# Altium project PCB_Project2.PrjPCB
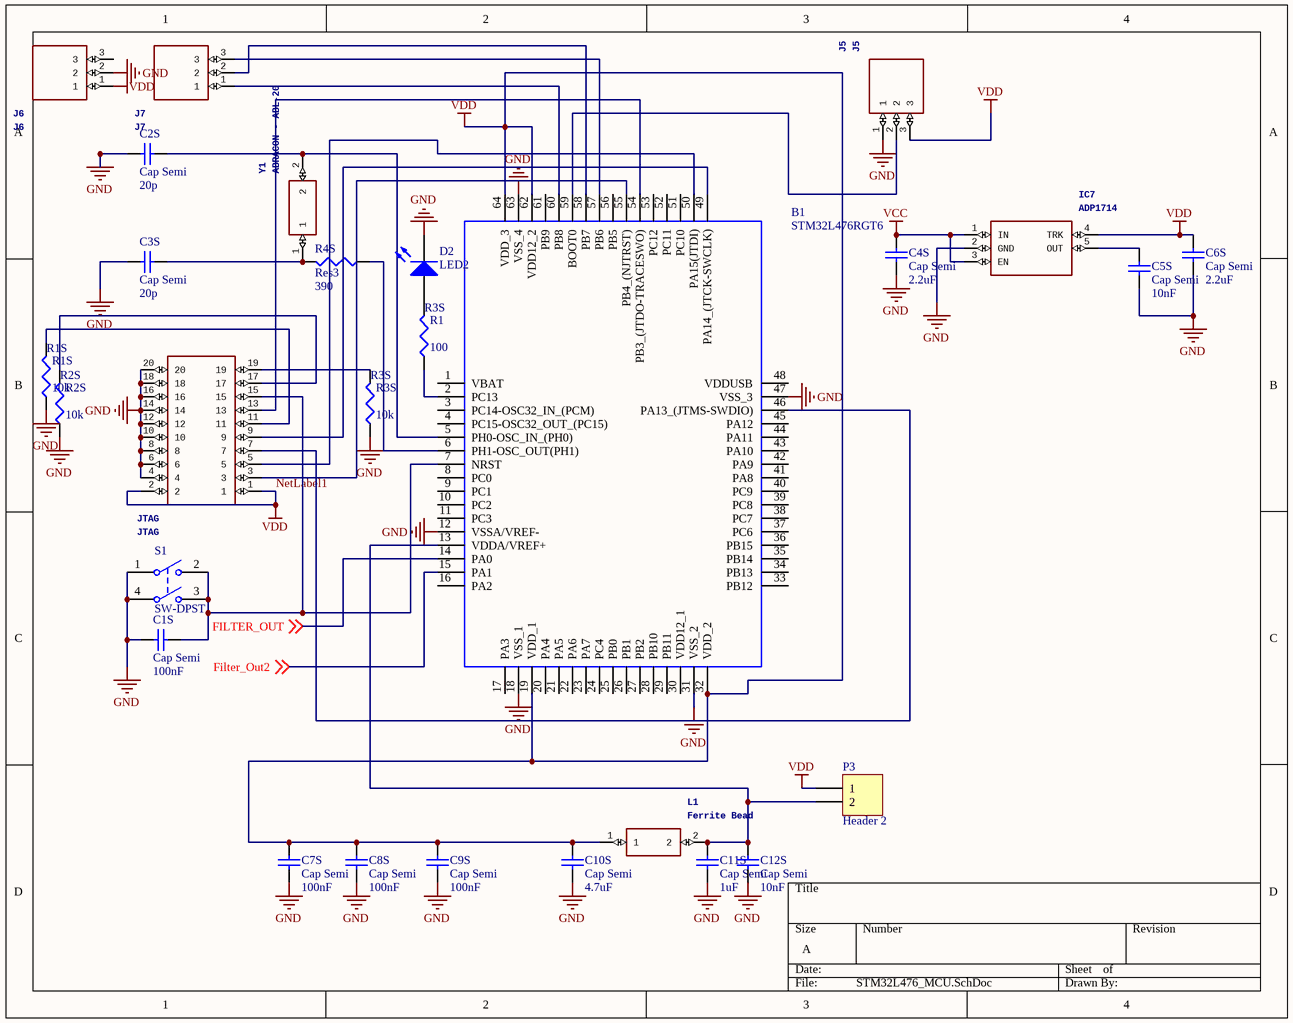
[diagram p0: STM32L476_MCU.SchDoc]
4 sheets, 109 parts. Net scope: global (net labels, ports and power ports of the same name join across sheets).
Board file: PCB1.PcbDoc
Sheets:
  STM32L476_MCU.SchDoc
  Power_Supply.SchDoc
  Mic_Circuit.SchDoc
  ButterWorth_8th_order_Filter.SchDoc

## Sheet STM32L476_MCU.SchDoc
size A

### Parts
B1  STM32L476RGT6  [QFP50P1200X1200X160-64N]
C1S  Cap Semi  value 100nF  [1608[0603]]
C2S  Cap Semi  value 20p  [1608[0603]]
C3S  Cap Semi  value 20p  [1608[0603]]
C4S  Cap Semi  value 2.2uF  [1608[0603]]
C5S  Cap Semi  value 10nF  [1608[0603]]
C6S  Cap Semi  value 2.2uF  [1608[0603]]
C7S  Cap Semi  value 100nF  [1608[0603]]
C8S  Cap Semi  value 100nF  [1608[0603]]
C9S  Cap Semi  value 100nF  [1608[0603]]
C10S  Cap Semi  value 4.7uF  [1608[0603]]
C11S  Cap Semi  value 1uF  [1608[0603]]
C12S  Cap Semi  value 10nF  [1608[0603]]
D2  LED2  [1608[0603]]
IC7  ADP1714  [SOT95P280X100-5N]
J5  J5  [HDRV3W95P0X254_1X3_762X254X869]
J6  J6  [HDRV3W95P0X254_1X3_762X254X869]
J7  J7  [HDRV3W95P0X254_1X3_762X254X869]
JTAG  JTAG  [SAMTEC_SSW-110-01-G]
L1  Ferrite Bead  [BEADC1608X95N]
P3  Header 2  [HDR1X2]
R1  R3S  value 100  [1608[0603]]
R1S  R1S  value 10k  [1608[0603]]
R2S  R2S  value 10k  [1608[0603]]
R3S  R3S  value 10k  [1608[0603]]
R4S  Res3  value 390  [1608[0603]]
S1  SW-DPST  [D6C10F1LFS]
Y1  ABRACON - ABL-20  [HC/49US_(AT49)PTH]

### Nets
GND: B1.12(VSSA/VREF-) B1.18(VSS_1) B1.31(VSS_2) B1.47(VSS_3) B1.63(VSS_4) C1S.1 C2S.1 C3S.1 C4S.1 C5S.1 C6S.1 C7S.1 C8S.1 C9S.1 C10S.1 C11S.1 C12S.1 D2.2(K) IC7.2(GND) J5.1 J6.2 JTAG.4 JTAG.6 JTAG.8 JTAG.10 JTAG.12 JTAG.14 JTAG.16 JTAG.18 JTAG.20 R1S.2 R2S.2 R3S.2 S1.1(COMMON1) S1.4(COMMON2)
VCC: C4S.2 IC7.1(IN) IC7.3(EN)
VDD: B1.19(VDD_1) B1.32(VDD_2) B1.62(VDD12_2) B1.64(VDD_3) C6S.2 C7S.2 C8S.2 C9S.2 C10S.2 IC7.4(TRK) J5.3 J6.1 JTAG.1 JTAG.2 L1.1 P3.1  [also labelled NetLabel1]
FILTER_OUT: B1.14(PA0) ; off-sheet FILTER_OUT
Filter_Out2: B1.15(PA1) ; off-sheet Filter_Out2
NetB1_2: B1.2(PC13) R1.2
NetB1_5: B1.5(PH0-OSC_IN_(PH0)) C2S.2 Y1.2
NetB1_6: B1.6(PH1-OSC_OUT(PH1)) R4S.2
NetB1_7: B1.7(NRST) C1S.2 JTAG.15 S1.2(NO1) S1.3(NO2)
NetB1_13: B1.13(VDDA/VREF+) C11S.2 C12S.2 L1.2 P3.2
NetB1_46: B1.46(PA13_(JTMS-SWDIO)) JTAG.7
NetB1_49: B1.49(PA14_(JTCK-SWCLK)) JTAG.9
NetB1_50: B1.50(PA15(JTDI)) JTAG.5
NetB1_54: B1.54(PB3_(JTDO-TRACESWO)) JTAG.13
NetB1_55: B1.55(PB4_(NJTRST)) JTAG.3
NetB1_57: B1.57(PB6) J7.3
NetB1_58: B1.58(PB7) J7.2
NetB1_59: B1.59(BOOT0) J5.2
NetB1_60: B1.60(PB8) J7.1
NetC3S_2: C3S.2 R4S.1 Y1.1
NetC5S_2: C5S.2 IC7.5(OUT)
NetD2_1: D2.1(A) R1.1
NetJTAG_11: JTAG.11 R1S.1
NetJTAG_17: JTAG.17 R2S.1
NetJTAG_19: JTAG.19 R3S.1

Not connected (* = marked no-connect by the designer): B1 1(VBAT) 3(PC14-OSC32_IN_(PCM)) 4(PC15-OSC32_OUT_(PC15)) 8(PC0) 9(PC1) 10(PC2) 11(PC3) 16(PA2) 17(PA3) 20(PA4) 21(PA5) 22(PA6) 23(PA7) 24(PC4) 25(PB0) 26(PB1) 27(PB2) 28(PB10) 29(PB11) 30(VDD12_1) 33(PB12) 34(PB13) 35(PB14) 36(PB15) 37(PC6) 38(PC7) 39(PC8) 40(PC9) 41(PA8) 42(PA9) 43(PA10) 44(PA11) 45(PA12) 48(VDDUSB) 51(PC10) 52(PC11) 53(PC12) 56(PB5) 61(PB9); J6 3

### Library data of the parts
B1 = STM32L476RGT6: ARM MCU 32-bit 80MHz 1024KB  LQFP64 STMicroelectronics STM32L476RGT6, 32bit ARM Cortex M4 MCU, 80MHz, 1 MB Flash, 64-Pin LQFP; Geometry.Height: 1.6mm; Manufacturer_Name: STMicroelectronics; Manufacturer_Part_Number: STM32L476RGT6; RS Part Number: 1658235; RS Price/Stock: http://uk.rs-online.com/web/p/products/1658235; Arrow Part Number: STM32L476RGT6; Arrow Price/Stock: https://www.arrow.com/en/products/stm32l476rgt6/stmicroelectronics; Datasheet Link: https://componentsearchengine.com/Datasheets/1/STM32L476RGT6.pdf
C1S C2S C3S C4S C5S C6S C7S C8S C9S C10S C11S C12S = Cap Semi: Capacitor (Semiconductor SIM Model); Published: 8-Jun-2000; LatestRevisionDate: 29-May-2009; LatestRevisionNote: IPC-7351 Footprint Added.; PackageReference: C1206; Publisher: Altium Limited; PackageDescription: Chip Capacitor
D2 = LED2: Typical RED, GREEN, YELLOW, AMBER GaAs LED; Published: 8-Jun-2000; LatestRevisionDate: 17-Jul-2002; LatestRevisionNote: Re-released for DXP Platform.; PackageVersion: Feb-2002; PackageReference: 3.2X1.6X1.1; Publisher: Altium Limited; PackageDescription: SM LED; 2 Flat Leads
IC7 = ADP1714AUJZ-3.3-R7: Manufacturer_Name: Analog Devices; GateName_1: G$1; SymbolName_1: ADP1714AUJZ-3.3-R7; LibraryName: ADP1714AUJZ-3.3-R7; DeviceSetName: ADP1714AUJZ-3.3-R7; Package: SOT95P280X100-5N; Manufacturer_Part_Number: ADP1714AUJZ-3.3-R7; Arrow_Part_Number: ADP1714AUJZ-3.3-R7; Height: mm
J5-J7 = 61300311121: Manufacturer_Name: Wurth Elektronik; GateName_1: G$1; SymbolName_1: 61300311121; LibraryName: 61300311121; DeviceSetName: 61300311121; Package: HDRV3W95P0X254_1X3_762X254X869; Manufacturer_Part_Number: 61300311121; RS_Part_Number: 1725145; RS_Price-Stock: http://uk.rs-online.com/web/p/products/1725145; Arrow_Part_Number: 61300311121; Arrow_Price-Stock: http://uk.rs-online.com/web/p/products/1725145; Height: 8.69mm
JTAG = SSW-110-01-G-D: Manufacturer_Name: SAMTEC; GateName_1: G$1; SymbolName_1: SSW-110-01-G-D; LibraryName: SSW-110-01-G-D; DeviceSetName: SSW-110-01-G-D; Package: SAMTEC_SSW-110-01-G; Manufacturer_Part_Number: SSW-110-01-G-D; RS_Part_Number: 7655727P; RS_Price-Stock: http://uk.rs-online.com/web/p/products/7655727P; Arrow_Part_Number: SSW-110-01-G-D; Arrow_Price-Stock: https://www.arrow.com/en/products/ssw-110-01-g-d/samtec; Height: mm
L1 = BK1608HS601-T: Manufacturer_Name: TAIYO YUDEN; GateName_1: G$1; SymbolName_1: BK1608HS601-T; LibraryName: BK1608HS601-T; DeviceSetName: BK1608HS601-T; Package: BEADC1608X95N; Manufacturer_Part_Number: BK1608HS601-T; Arrow_Part_Number: BK1608HS601-T; Height: 0.95mm
P3 = Header 2: Header, 2-Pin; LatestRevisionDate: 17-Jul-2002; LatestRevisionNote: Re-released for DXP Platform.; Publisher: Altium Limited
R1 R1S R2S R3S R4S = Res3: Resistor; Published: 8-Jun-2000; LatestRevisionDate: 29-May-2009; LatestRevisionNote: IPC-7351 Footprint Added.; PackageReference: J1-0603; Publisher: Altium Limited; PackageDescription: Chip Resistor
S1 = SW-DPST: Double-Pole, Single-Throw Switch; Published: 24-Mar-1999; LatestRevisionDate: 17-Jul-2002; LatestRevisionNote: Re-released for DXP Platform.; PackageReference: DPST-4; Publisher: Altium Limited; PackageDescription: Switch; 4 Leads
Y1 = ABL-20.000MHZ-B2: GateName_1: G$1; SymbolName_1: ABL-20.000MHZ-B2; LibraryName: ABL-20.000MHZ-B2; DeviceSetName: ABL-20.000MHZ-B2; Package: HC/49US_(AT49)PTH; Manufacturer_Name: ABRACON; Manufacturer_Part_Number: ABL-20.000MHZ-B2; RS_Part_Number: 1710202; RS_Price-Stock: http://uk.rs-online.com/web/p/products/1710202; Arrow_Part_Number: ABL-20.000MHZ-B2; Arrow_Price-Stock: https://www.arrow.com/en/products/abl-20.000mhz-b2/abracon; Height: mm

## Sheet Power_Supply.SchDoc
size A
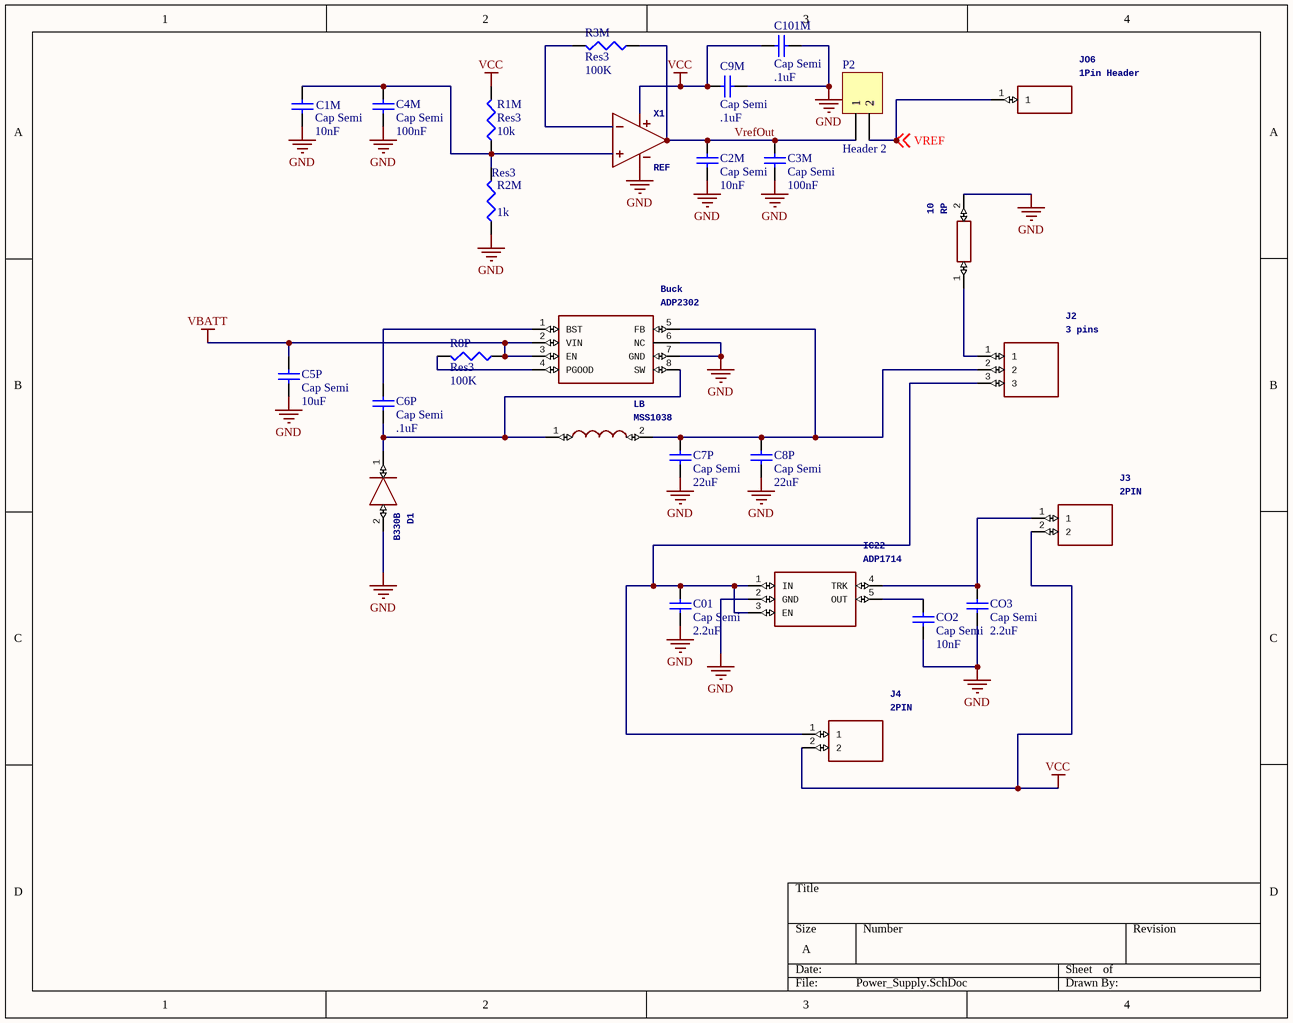
[diagram p1: Power_Supply.SchDoc]

### Parts
10  RP  [RESAD3800W75L1600D550]
Buck  ADP2302  [SOIC127P600X175-9N]
C01  Cap Semi  value 2.2uF  [1608[0603]]
C1M  Cap Semi  value 10nF  [CAPPM6032X280N]
C2M  Cap Semi  value 10nF  [CAPPM6032X280N]
C3M  Cap Semi  value 100nF  [1608[0603]]
C4M  Cap Semi  value 100nF  [1608[0603]]
C5P  Cap Semi  value 10uF  [1608[0603]]
C6P  Cap Semi  value .1uF  [1608[0603]]
C7P  Cap Semi  value 22uF  [1608[0603]]
C8P  Cap Semi  value 22uF  [1608[0603]]
C9M  Cap Semi  value .1uF  [1608[0603]]
C101M  Cap Semi  value .1uF  [CAPPM6032X280N]
CO2  Cap Semi  value 10nF  [1608[0603]]
CO3  Cap Semi  value 2.2uF  [1608[0603]]
D1  B330B  [DIOM5336X250N]
IC22  ADP1714  [SOT95P280X100-5N]
J2  3 pins  [HDRV3W95P0X254_1X3_762X254X869]
J3  2PIN  [HDRV2W110P0X254_1X2_508X254X85]
J4  2PIN  [HDRV2W110P0X254_1X2_508X254X85]
JO6  1Pin Header  [68000-401HLF]
LB  MSS1038  [INDM102102X400N]
P2  Header 2  [HDRV2W110P0X254_1X2_508X254X85]
R1M  Res3  value 10k  [1608[0603]]
R2M  Res3  value 1k  [1608[0603]]
R3M  Res3  value 100K  [1608[0603]]
R8P  Res3  value 100K  [1608[0603]]
X1  REF  [SOT95P290X145-5N]

### Nets
GND: 10.2 Buck.6(NC) Buck.7(GND) C01.1 C1M.1 C2M.1 C3M.1 C4M.1 C5P.1 C7P.1 C8P.1 C9M.1 C101M.1 CO2.1 CO3.1 D1.2(A) IC22.2(GND) R2M.2 X1.2(V-)
VBATT: Buck.2(VIN) Buck.3(EN) C5P.2 R8P.2
VCC: C9M.2 C101M.2 J3.2 J4.2 R1M.1 X1.5(V+)
VREF: JO6.1 P2.2 ; off-sheet VREF
VrefOut: C2M.2 C3M.2 P2.1 R3M.2 X1.1(OUT)
Net10_1: 10.1 J2.1
NetBuck_1: Buck.1(BST) C6P.2
NetBuck_4: Buck.4(PGOOD) R8P.1
NetBuck_5: Buck.5(FB) C7P.2 C8P.2 J2.2 LB.2
NetBuck_8: Buck.8(SW) C6P.1 D1.1(K) LB.1
NetC01_2: C01.2 IC22.1(IN) IC22.3(EN) J2.3 J4.1
NetC1M_2: C1M.2 C4M.2 R1M.2 R2M.1 X1.3(IN+)
NetCO2_2: CO2.2 IC22.5(OUT)
NetCO3_2: CO3.2 IC22.4(TRK) J3.1
NetR3M_1: R3M.1 X1.4(IN-)

### Library data of the parts
10 = ROX3SJ220R: Manufacturer_Name: TE Connectivity; GateName_1: G$1; Allied_Number: 70063816; SymbolName_1: ROX3SJ220R; LibraryName: ROX3SJ220R; DeviceSetName: ROX3SJ220R; Package: RESAD3800W75L1600D550; Manufacturer_Part_Number: ROX3SJ220R; RS_Part_Number: 1615998; RS_Price-Stock: http://uk.rs-online.com/web/p/products/1615998; Allied_Price-Stock: https://www.alliedelec.com/te-connectivity-rox3sj220r/70063816/; Arrow_Part_Number: ROX3SJ220R; Arrow_Price-Stock: https://www.arrow.com/en/products/rox3sj220r/te-connectivity; Height: mm
Buck = ADP2302ARDZ-5.0-R7: Manufacturer_Name: Analog Devices; GateName_1: G$1; SymbolName_1: ADP2302ARDZ-5.0-R7; LibraryName: ADP2302ARDZ-5.0-R7; DeviceSetName: ADP2302ARDZ-5.0-R7; Package: SOIC127P600X175-9N; Manufacturer_Part_Number: ADP2302ARDZ-5.0-R7; RS_Part_Number: 7591815P; RS_Price-Stock: http://uk.rs-online.com/web/p/products/7591815P; Arrow_Part_Number: ADP2302ARDZ-5.0-R7; Arrow_Price-Stock: https://www.arrow.com/en/products/adp2302ardz-5.0-r7/analog-devices; Height: mm
C01 C1M C2M C3M C4M C5P C6P C7P C8P C9M C101M CO2 CO3 = Cap Semi: Capacitor (Semiconductor SIM Model); Published: 8-Jun-2000; LatestRevisionDate: 29-May-2009; LatestRevisionNote: IPC-7351 Footprint Added.; PackageReference: C1206; Publisher: Altium Limited; PackageDescription: Chip Capacitor
D1 = B330B-13-F: Manufacturer_Name: Diodes Inc.; GateName_1: G$1; SymbolName_1: B330B-13-F; LibraryName: B330B-13-F; DeviceSetName: B330B-13-F; Package: DIOM5336X250N; Manufacturer_Part_Number: B330B-13-F; RS_Part_Number: 9228339; RS_Price-Stock: http://uk.rs-online.com/web/p/products/9228339; Arrow_Part_Number: B330B-13-F; Arrow_Price-Stock: https://www.arrow.com/en/products/b330b-13-f/diodes-incorporated; Height: 2.5mm
IC22 = ADP1714AUJZ-3.3-R7: as IC7 on sheet STM32L476_MCU; SymbolName_1: ADP1714AUJZ-3.3-R7; LibraryName: ADP1714AUJZ-3.3-R7; DeviceSetName: ADP1714AUJZ-3.3-R7; Package: SOT95P280X100-5N; Manufacturer_Part_Number: ADP1714AUJZ-3.3-R7; Arrow_Part_Number: ADP1714AUJZ-3.3-R7; Height: mm
J2 = 61300311121: as J5 on sheet STM32L476_MCU; SymbolName_1: 61300311121; LibraryName: 61300311121; DeviceSetName: 61300311121; Package: HDRV3W95P0X254_1X3_762X254X869; Manufacturer_Part_Number: 61300311121; RS_Part_Number: 1725145; RS_Price-Stock: http://uk.rs-online.com/web/p/products/1725145; Arrow_Part_Number: 61300311121; Arrow_Price-Stock: http://uk.rs-online.com/web/p/products/1725145; Height: 8.69mm
J3 J4 = 61300211121: Manufacturer_Name: Wurth Elektronik; GateName_1: G$1; SymbolName_1: 61300211121; LibraryName: 61300211121; DeviceSetName: 61300211121; Package: HDRV2W110P0X254_1X2_508X254X85; Manufacturer_Part_Number: 61300211121; RS_Part_Number: 8281581P; RS_Price-Stock: http://uk.rs-online.com/web/p/products/8281581P; Arrow_Part_Number: 61300211121; Arrow_Price-Stock: http://uk.rs-online.com/web/p/products/8281581P; Height: 8.54mm
JO6 = 68000-401HLF: Manufacturer_Name: FCI; GateName_1: G$1; SymbolName_1: 68000-401HLF; LibraryName: 68000-401HLF; DeviceSetName: 68000-401HLF; Package: 68000-401HLF; Manufacturer_Part_Number: 68000-401HLF; RS_Part_Number: 8632706; RS_Price-Stock: http://uk.rs-online.com/web/p/products/8632706; Arrow_Part_Number: 68000-401HLF; Arrow_Price-Stock: https://www.arrow.com/en/products/68000-401hlf/amphenol-fci; Height: mm
LB = MSS1038-183MLB: Manufacturer_Name: COILCRAFT; GateName_1: G$1; SymbolName_1: MSS1038-183MLB; LibraryName: MSS1038-183MLB; DeviceSetName: MSS1038-183MLB; Package: INDM102102X400N; Manufacturer_Part_Number: MSS1038-183MLB; Arrow_Part_Number: MSS1038-183MLB; Height: 4mm
P2 = Header 2: Header, 2-Pin; LatestRevisionDate: 17-Jul-2002; LatestRevisionNote: Re-released for DXP Platform.; Publisher: Altium Limited
R1M R2M R3M R8P = Res3: Resistor; Published: 8-Jun-2000; LatestRevisionDate: 29-May-2009; LatestRevisionNote: IPC-7351 Footprint Added.; PackageReference: J1-0603; Publisher: Altium Limited; PackageDescription: Chip Resistor
X1 = OPAMP2: GateName_1: G$1; SymbolName_1: OPAMP2; LibraryName: Opamps; DeviceSetName: OPAMP2; Package: S8

## Sheet Mic_Circuit.SchDoc
size A
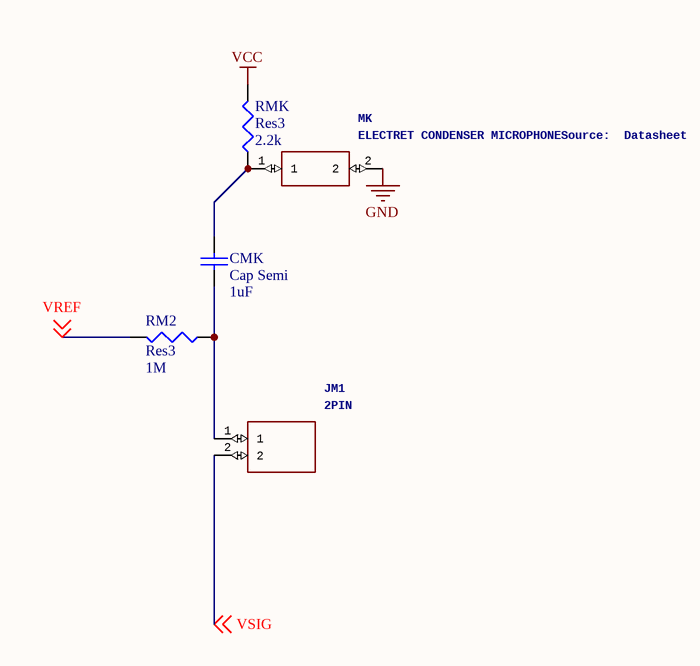
[diagram p2: Mic_Circuit.SchDoc]

### Parts
CMK  Cap Semi  value 1uF  [1608[0603]]
JM1  2PIN  [HDRV2W110P0X254_1X2_508X254X85]
MK  ELECTRET CONDENSER MICROPHONESource:  Datasheet  [CMA-4544PF-W]
RM2  Res3  value 1M  [1608[0603]]
RMK  Res3  value 2.2k  [1608[0603]]

### Nets
GND: MK.2
VCC: RMK.1
VREF: RM2.1 ; off-sheet VREF
VSIG: JM1.2 ; off-sheet VSIG
NetCMK_1: CMK.1 JM1.1 RM2.2
NetCMK_2: CMK.2 MK.1 RMK.2

### Library data of the parts
CMK = Cap Semi: Capacitor (Semiconductor SIM Model); Published: 8-Jun-2000; LatestRevisionDate: 29-May-2009; LatestRevisionNote: IPC-7351 Footprint Added.; PackageReference: C1206; Publisher: Altium Limited; PackageDescription: Chip Capacitor
JM1 = 61300211121: as J3 on sheet Power_Supply; SymbolName_1: 61300211121; LibraryName: 61300211121; DeviceSetName: 61300211121; Package: HDRV2W110P0X254_1X2_508X254X85; Manufacturer_Part_Number: 61300211121; RS_Part_Number: 8281581P; RS_Price-Stock: http://uk.rs-online.com/web/p/products/8281581P; Arrow_Part_Number: 61300211121; Arrow_Price-Stock: http://uk.rs-online.com/web/p/products/8281581P; Height: 8.54mm
MK = CMA-4544PF-W: Manufacturer_Name: CUI; GateName_1: G$1; SymbolName_1: CMA-4544PF-W; LibraryName: CMA-4544PF-W; DeviceSetName: CMA-4544PF-W; Package: CMA-4544PF-W; Manufacturer_Part_Number: CMA-4544PF-W; Arrow_Part_Number: CMA-4544PF-W; Arrow_Price-Stock: https://www.arrow.com/en/products/cma-4544pf-w/cui-inc; Height: mm
RM2 RMK = Res3: Resistor; Published: 8-Jun-2000; LatestRevisionDate: 29-May-2009; LatestRevisionNote: IPC-7351 Footprint Added.; PackageReference: J1-0603; Publisher: Altium Limited; PackageDescription: Chip Resistor

## Sheet ButterWorth_8th_order_Filter.SchDoc
size B
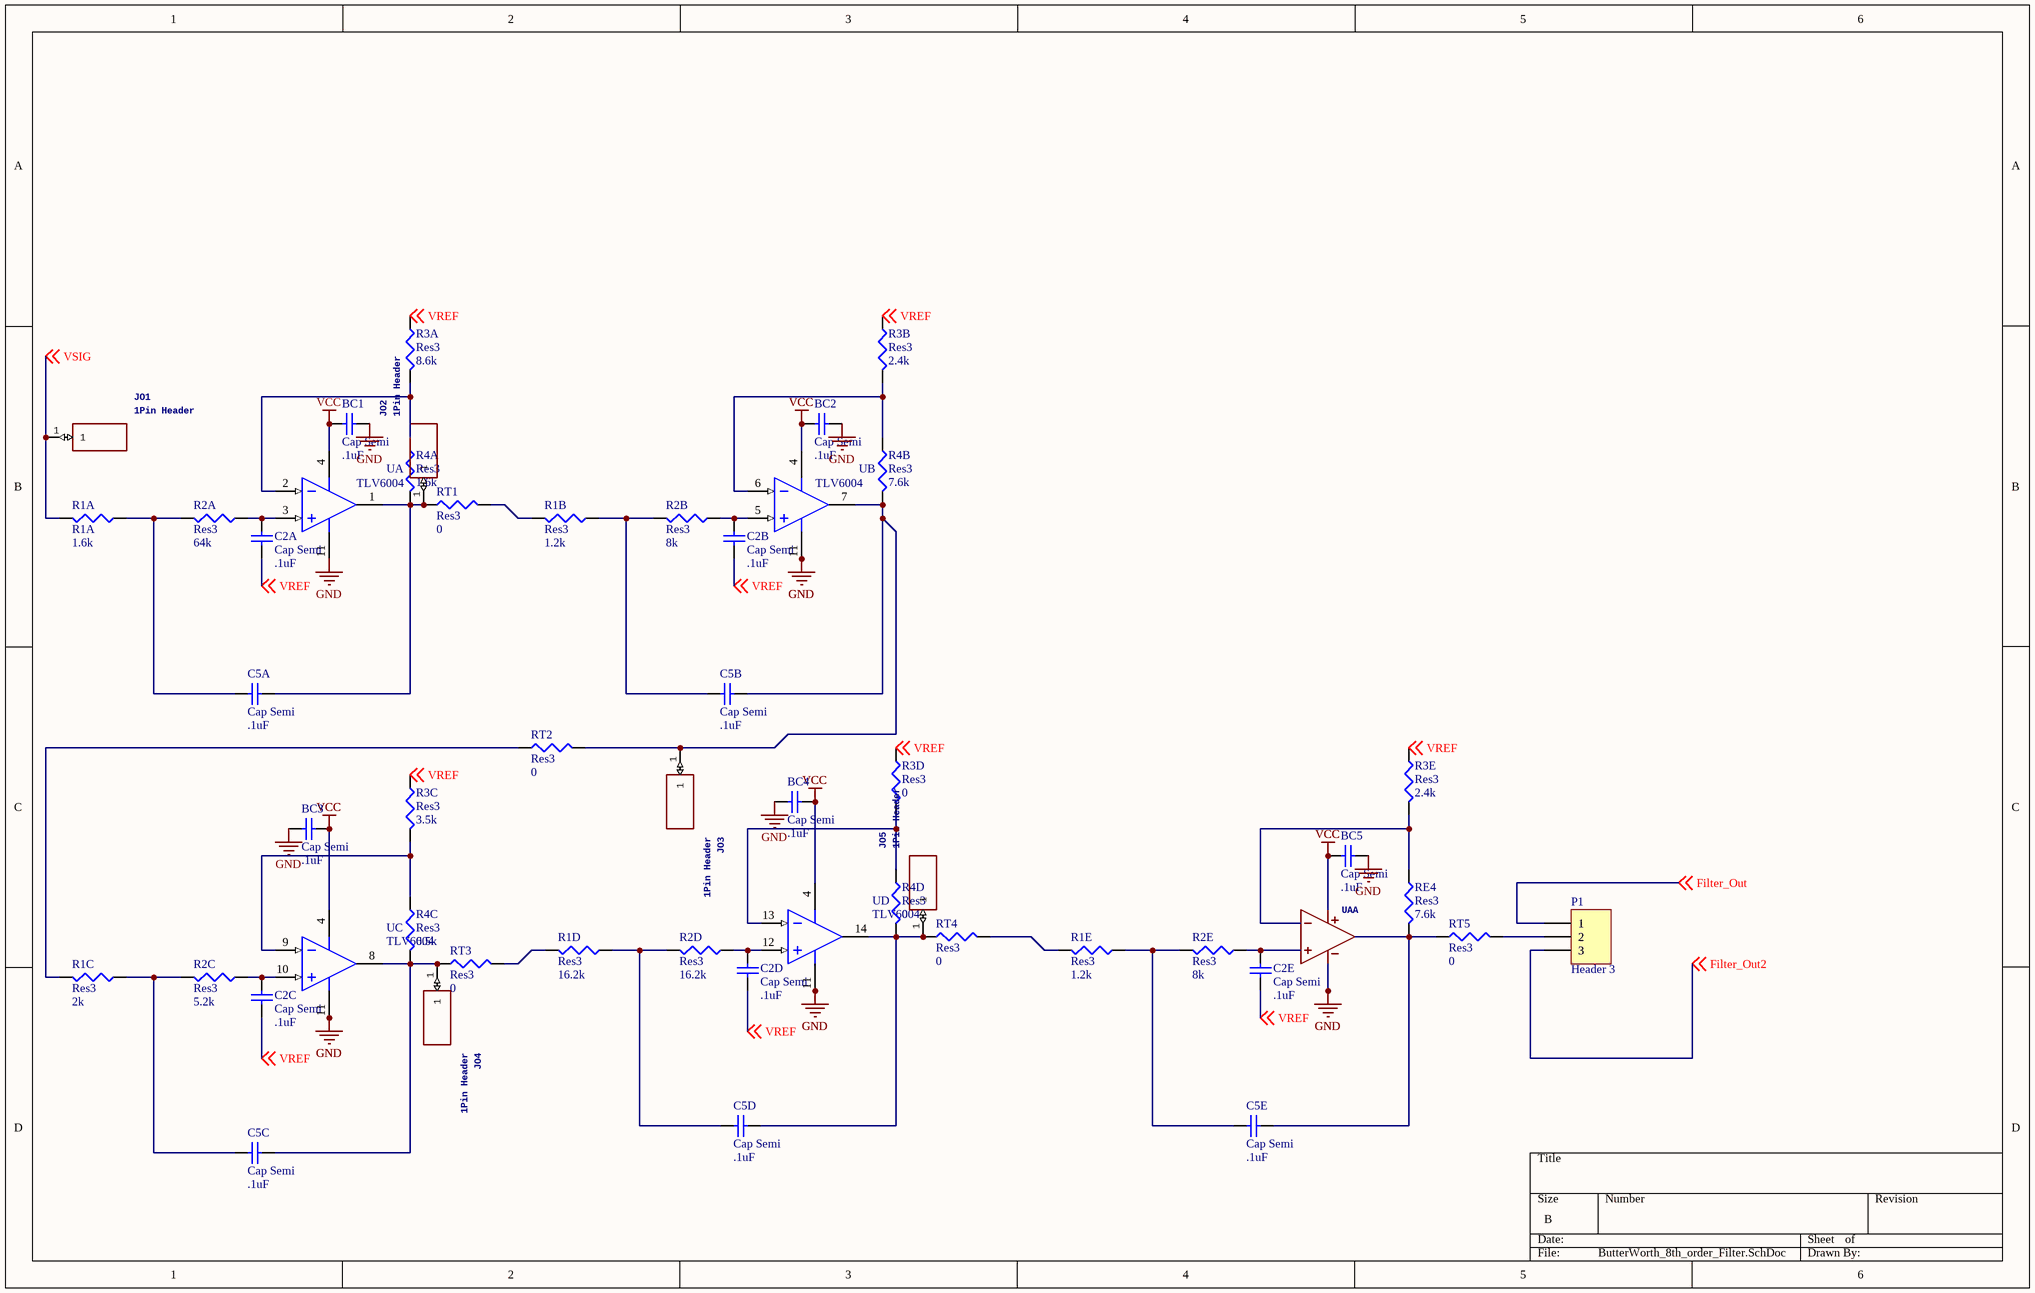
[diagram p3: ButterWorth_8th_order_Filter.SchDoc]

### Parts
BC1  Cap Semi  value .1uF  [1608[0603]]
BC2  Cap Semi  value .1uF  [1608[0603]]
BC3  Cap Semi  value .1uF  [1608[0603]]
BC4  Cap Semi  value .1uF  [1608[0603]]
BC5  Cap Semi  value .1uF  [1608[0603]]
C2A  Cap Semi  value .1uF  [1608[0603]]
C2B  Cap Semi  value .1uF  [1608[0603]]
C2C  Cap Semi  value .1uF  [1608[0603]]
C2D  Cap Semi  value .1uF  [1608[0603]]
C2E  Cap Semi  value .1uF  [1608[0603]]
C5A  Cap Semi  value .1uF  [C1206]
C5B  Cap Semi  value .1uF  [C1206]
C5C  Cap Semi  value .1uF  [C1206]
C5D  Cap Semi  value .1uF  [C1206]
C5E  Cap Semi  value .1uF  [C1206]
JO1  1Pin Header  [68000-401HLF]
JO2  1Pin Header  [68000-401HLF]
JO3  1Pin Header  [68000-401HLF]
JO4  1Pin Header  [68000-401HLF]
JO5  1Pin Header  [68000-401HLF]
P1  Header 3  [HDRV3W95P0X254_1X3_762X254X869]
R1A  R1A  value 1.6k  [1608[0603]]
R1B  Res3  value 1.2k  [1608[0603]]
R1C  Res3  value 2k  [1608[0603]]
R1D  Res3  value 16.2k  [1608[0603]]
R1E  Res3  value 1.2k  [1608[0603]]
R2A  Res3  value 64k  [1608[0603]]
R2B  Res3  value 8k  [1608[0603]]
R2C  Res3  value 5.2k  [1608[0603]]
R2D  Res3  value 16.2k  [1608[0603]]
R2E  Res3  value 8k  [1608[0603]]
R3A  Res3  value 8.6k  [1608[0603]]
R3B  Res3  value 2.4k  [1608[0603]]
R3C  Res3  value 3.5k  [1608[0603]]
R3D  Res3  value 0  [1608[0603]]
R3E  Res3  value 2.4k  [1608[0603]]
R4A  Res3  value 1.6k  [1608[0603]]
R4B  Res3  value 7.6k  [1608[0603]]
R4C  Res3  value 6.5k  [1608[0603]]
R4D  Res3  value 0  [1608[0603]]
RE4  Res3  value 7.6k  [1608[0603]]
RT1  Res3  value 0  [1608[0603]]
RT2  Res3  value 0  [1608[0603]]
RT3  Res3  value 0  [1608[0603]]
RT4  Res3  value 0  [1608[0603]]
RT5  Res3  value 0  [1608[0603]]
U  TLV6004  [SOP65P640X120-14N]  (parts A,B,C,D of 4)
UAA  Universal Opamp model that allows 4 different levels of simulation accuracy.  See ./examples/Educational/UniversalOpamp2.asc for details.  En and in are equivalent voltage and current noises.  Enk and ink are the respective corner frequencies.  Phimargin is used to set the 2nd pole or delay to the approximate phase margin for level.3a and level.3b.  This version uses the new, experimental level 2 switch as the output devices.  [SOT95P280X100-5N]  (value not drawn)

### Nets
GND: BC1.1 BC2.1 BC3.2 BC4.2 BC5.1 U.11(V-) UAA.2(V-)
VCC: BC1.2 BC2.2 BC3.1 BC4.1 BC5.2 U.4(V+) UAA.5(V+)
FILTER_OUT: P1.1 ; off-sheet Filter_Out
Filter_Out2: P1.3 ; off-sheet Filter_Out2
VREF: C2A.1 C2B.1 C2C.1 C2D.1 C2E.1 R3A.2 R3B.2 R3C.2 R3D.2 R3E.2 ; off-sheet VREF
VSIG: JO1.1 R1A.1 ; off-sheet VSIG
NetC2A_2: C2A.2 R2A.2 U.3(IN+)
NetC2B_2: C2B.2 R2B.2 U.5(IN+)
NetC2C_2: C2C.2 R2C.2 U.10(IN+)
NetC2D_2: C2D.2 R2D.2 U.12(IN+)
NetC2E_2: C2E.2 R2E.2 UAA.3(IN+)
NetC5A_1: C5A.1 JO2.1 R4A.1 RT1.2 U.1(OUT)
NetC5A_2: C5A.2 R1A.2 R2A.1
NetC5B_1: C5B.1 JO3.1 R4B.1 RT2.1 U.7(OUT)
NetC5B_2: C5B.2 R1B.2 R2B.1
NetC5C_1: C5C.1 JO4.1 R4C.1 RT3.2 U.8(OUT)
NetC5C_2: C5C.2 R1C.2 R2C.1
NetC5D_1: C5D.1 JO5.1 R4D.1 RT4.2 U.14(OUT)
NetC5D_2: C5D.2 R1D.2 R2D.1
NetC5E_1: C5E.1 RE4.1 RT5.2 UAA.1(OUT)
NetC5E_2: C5E.2 R1E.2 R2E.1
NetP1_2: P1.2 RT5.1
NetR1B_1: R1B.1 RT1.1
NetR1C_1: R1C.1 RT2.2
NetR1D_1: R1D.1 RT3.1
NetR1E_1: R1E.1 RT4.1
NetR3A_1: R3A.1 R4A.2 U.2(IN-)
NetR3B_1: R3B.1 R4B.2 U.6(IN-)
NetR3C_1: R3C.1 R4C.2 U.9(IN-)
NetR3D_1: R3D.1 R4D.2 U.13(IN-)
NetR3E_1: R3E.1 RE4.2 UAA.4(IN-)

### Library data of the parts
BC1-BC5 C2A C2B C2C C2D C2E C5A C5B C5C C5D C5E = Cap Semi: Capacitor (Semiconductor SIM Model); Published: 8-Jun-2000; LatestRevisionDate: 29-May-2009; LatestRevisionNote: IPC-7351 Footprint Added.; PackageReference: C1206; Publisher: Altium Limited; PackageDescription: Chip Capacitor
JO1-JO5 = 68000-401HLF: Manufacturer_Name: FCI; GateName_1: G$1; SymbolName_1: 68000-401HLF; LibraryName: 68000-401HLF; DeviceSetName: 68000-401HLF; Package: 68000-401HLF; Manufacturer_Part_Number: 68000-401HLF; RS_Part_Number: 8632706; RS_Price-Stock: http://uk.rs-online.com/web/p/products/8632706; Arrow_Part_Number: 68000-401HLF; Arrow_Price-Stock: https://www.arrow.com/en/products/68000-401hlf/amphenol-fci; Height: mm
P1 = Header 3: Header, 3-Pin; LatestRevisionDate: 17-Jul-2002; LatestRevisionNote: Re-released for DXP Platform.; Publisher: Altium Limited
R1A R1B R1C R1D R1E R2A R2B R2C R2D R2E R3A R3B R3C R3D R3E R4A R4B R4C R4D RE4 RT1-RT5 = Res3: Resistor; Published: 8-Jun-2000; LatestRevisionDate: 29-May-2009; LatestRevisionNote: IPC-7351 Footprint Added.; PackageReference: J1-0603; Publisher: Altium Limited; PackageDescription: Chip Resistor
U = LP2901D: Low Power Quad Differential Comparator; Published: 16-Jan-2001; LatestRevisionDate: 13-Apr-2006; LatestRevisionNote: IPC-7351 Footprint Added.; DatasheetVersion: May-1988; PackageVersion: Jan-1998; PackageReference: D014; Publisher: Altium Limited; PackageDescription: 14-Pin Small Outline Integrated Circuit 1.27 mm Pitch; Code_IPC: SOIC127P600-14; ComponentLink1Description: Manufacturer Link; ComponentLink1URL: http://www.ti.com/; ComponentLink2Description: Datasheet; ComponentLink2URL: http://www-s.ti.com/sc/ds/lp2901.pdf
UAA = UNIVERSALOPAMP2: GateName_1: G$1; SymbolName_1: UNIVERSALOPAMP2; LibraryName: Opamps; DeviceSetName: UNIVERSALOPAMP2; Package: S8

## Nets that join several sheets
GND: STM32L476_MCU (35 pins), Power_Supply (19 pins), Mic_Circuit (MK.2), ButterWorth_8th_order_Filter (7 pins)
VCC: STM32L476_MCU (C4S.2 IC7.1 IC7.3), Power_Supply (6 pins), Mic_Circuit (RMK.1), ButterWorth_8th_order_Filter (7 pins)
FILTER_OUT: STM32L476_MCU (B1.14), ButterWorth_8th_order_Filter (P1.1)
Filter_Out2: STM32L476_MCU (B1.15), ButterWorth_8th_order_Filter (P1.3)
VREF: Power_Supply (JO6.1 P2.2), Mic_Circuit (RM2.1), ButterWorth_8th_order_Filter (10 pins)
VSIG: Mic_Circuit (JM1.2), ButterWorth_8th_order_Filter (JO1.1 R1A.1)